# EAGLE design NervousSys_V5 (EAGLE 9.2.2)
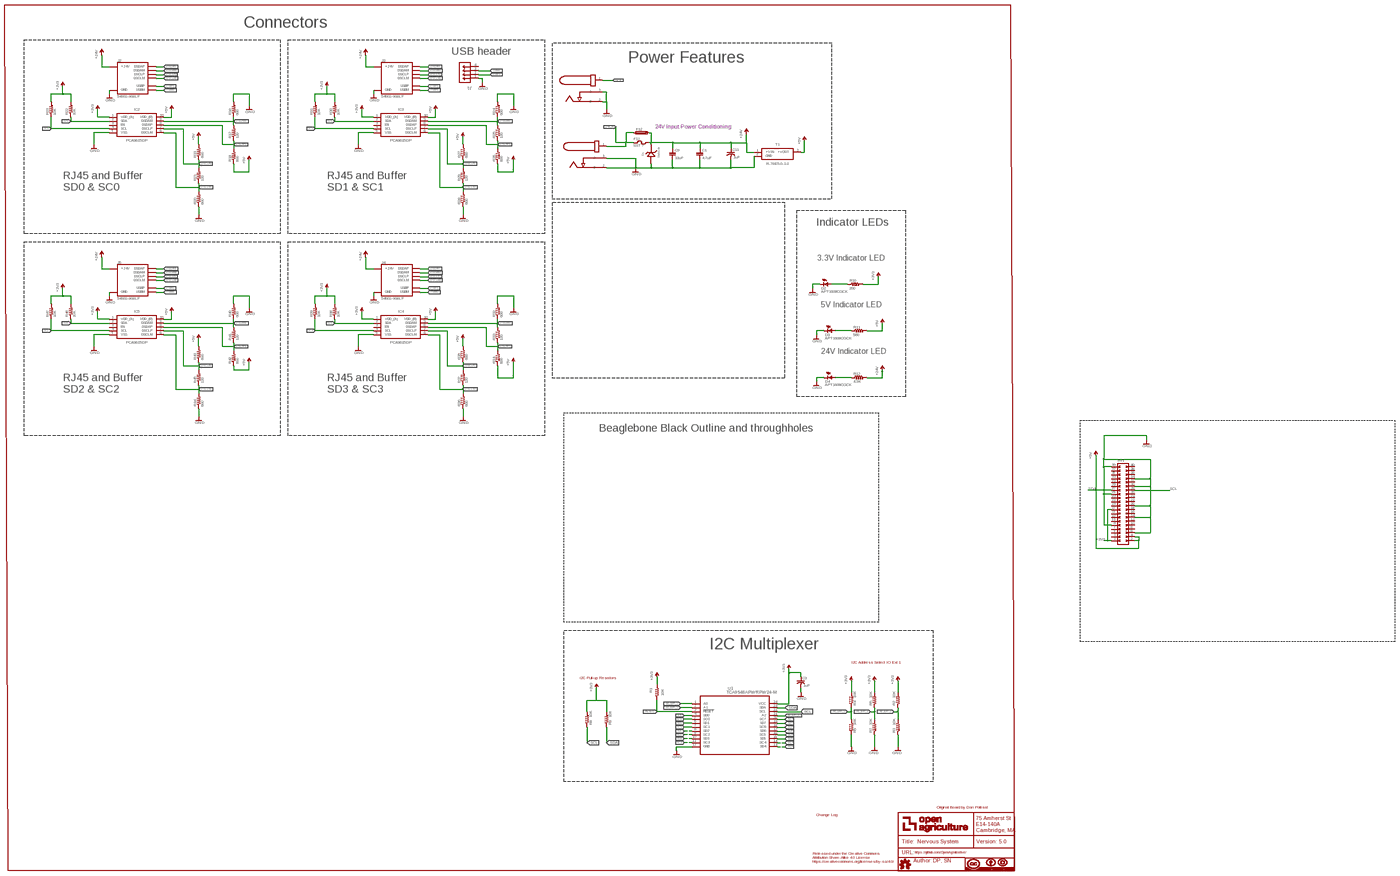
[diagram p0: schematic, sheet 1, overview]
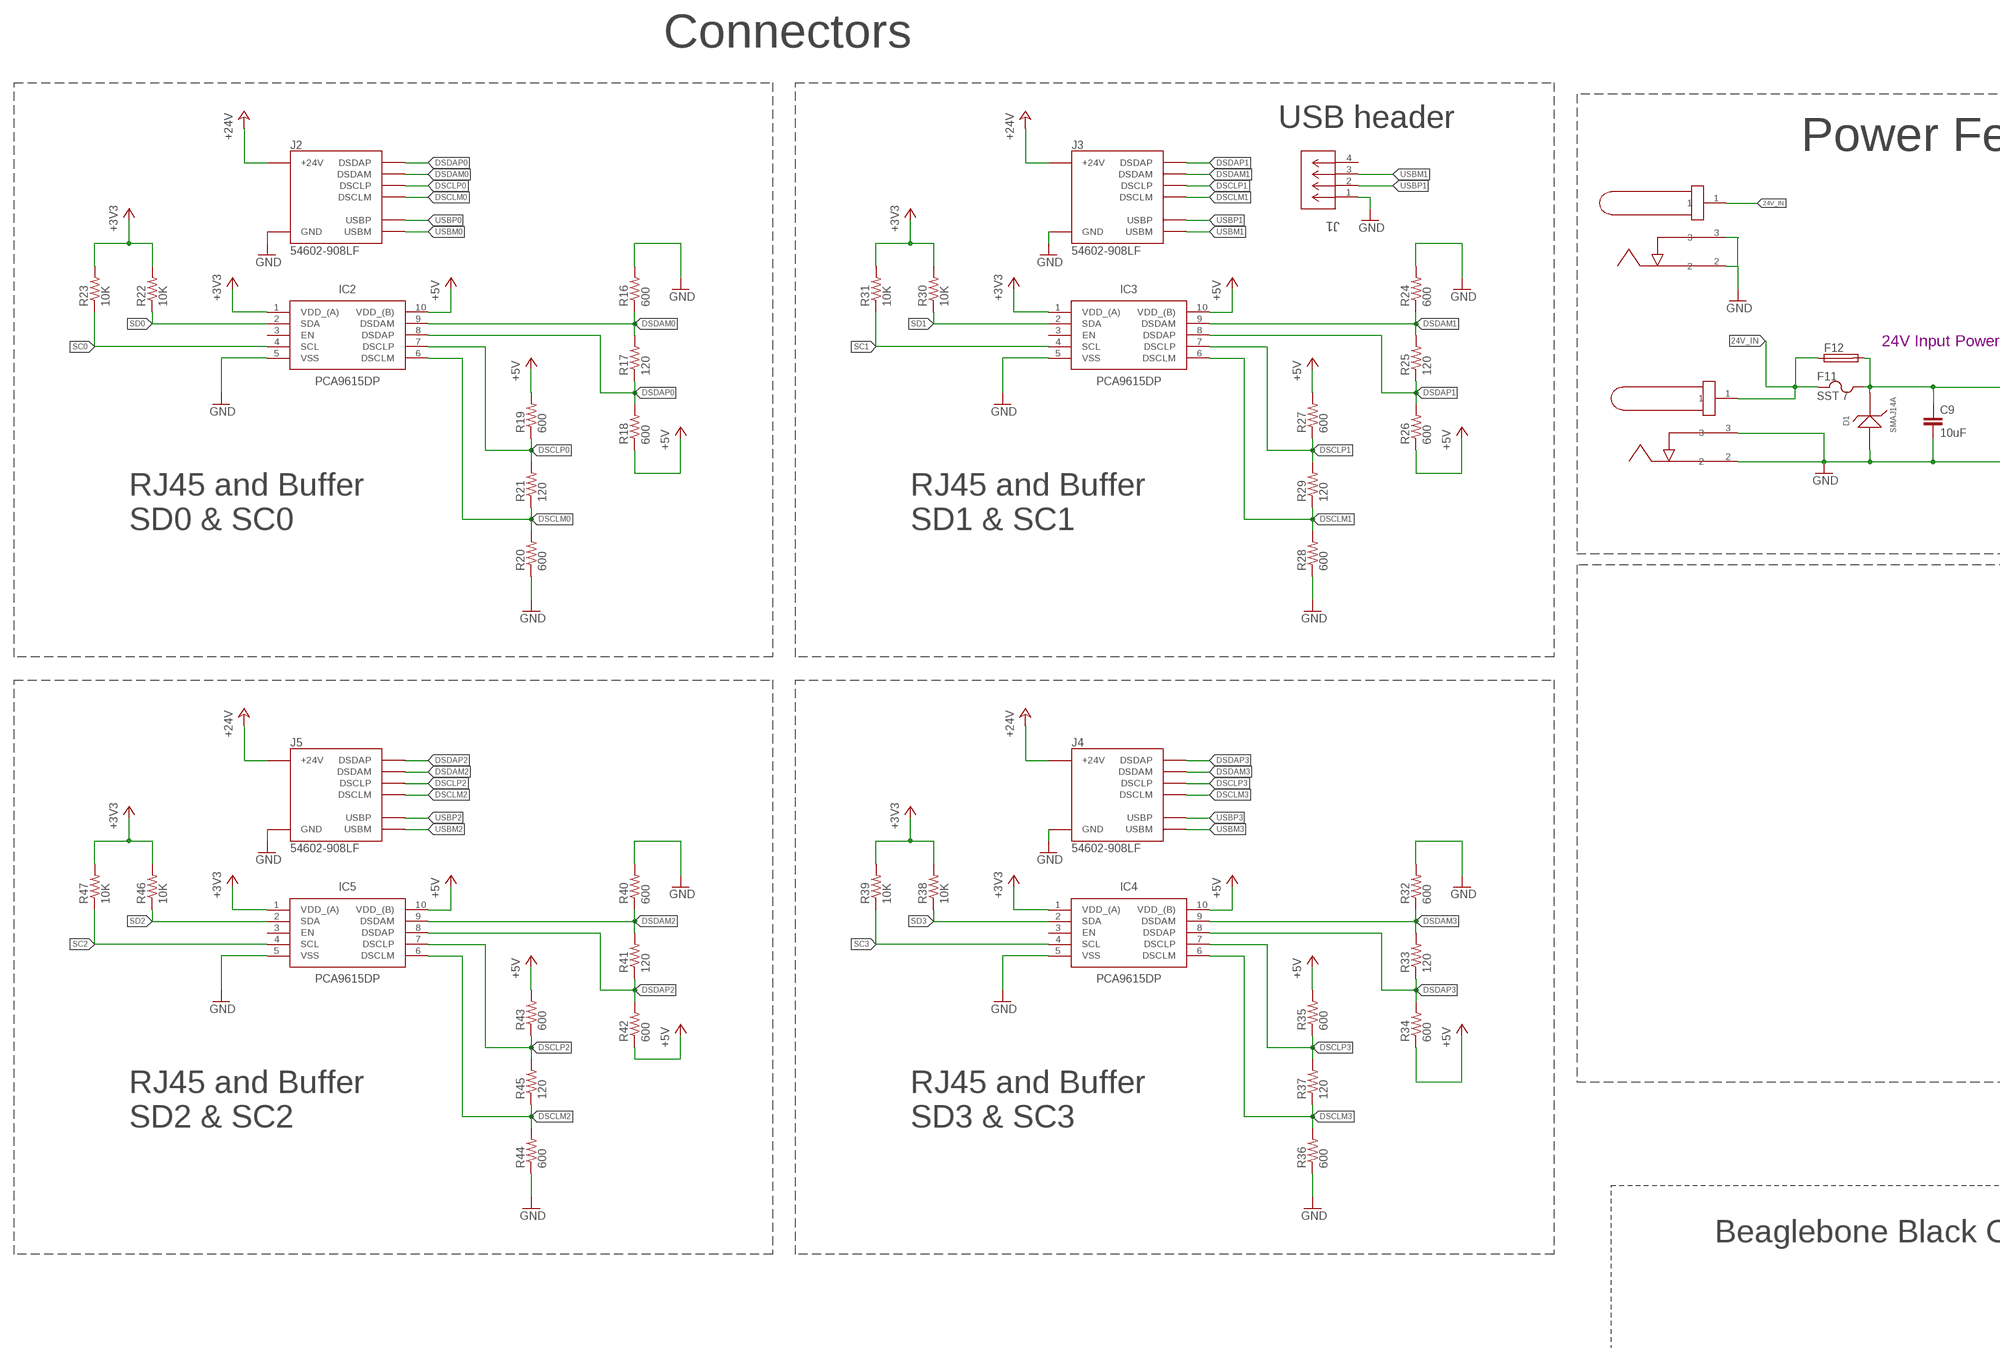
[diagram p1: schematic, sheet 1, part 1 of 4]
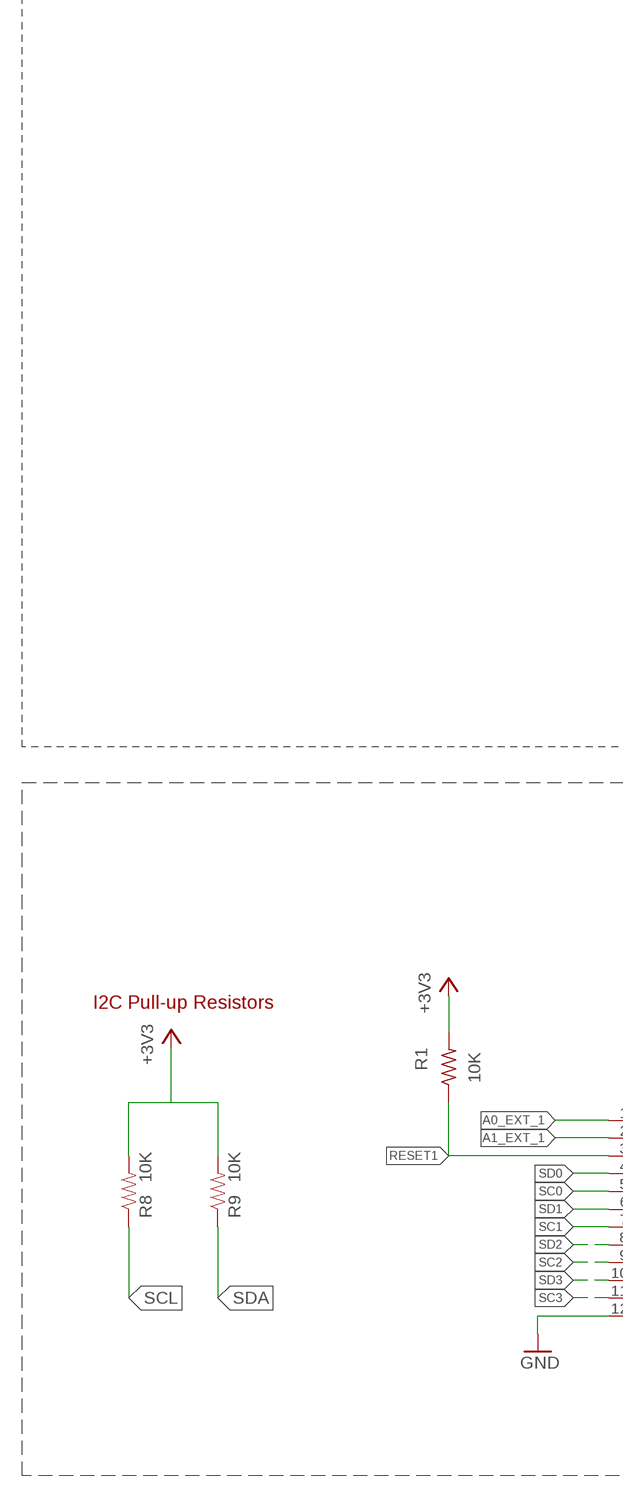
[diagram p2: schematic, sheet 1, part 2 of 4]
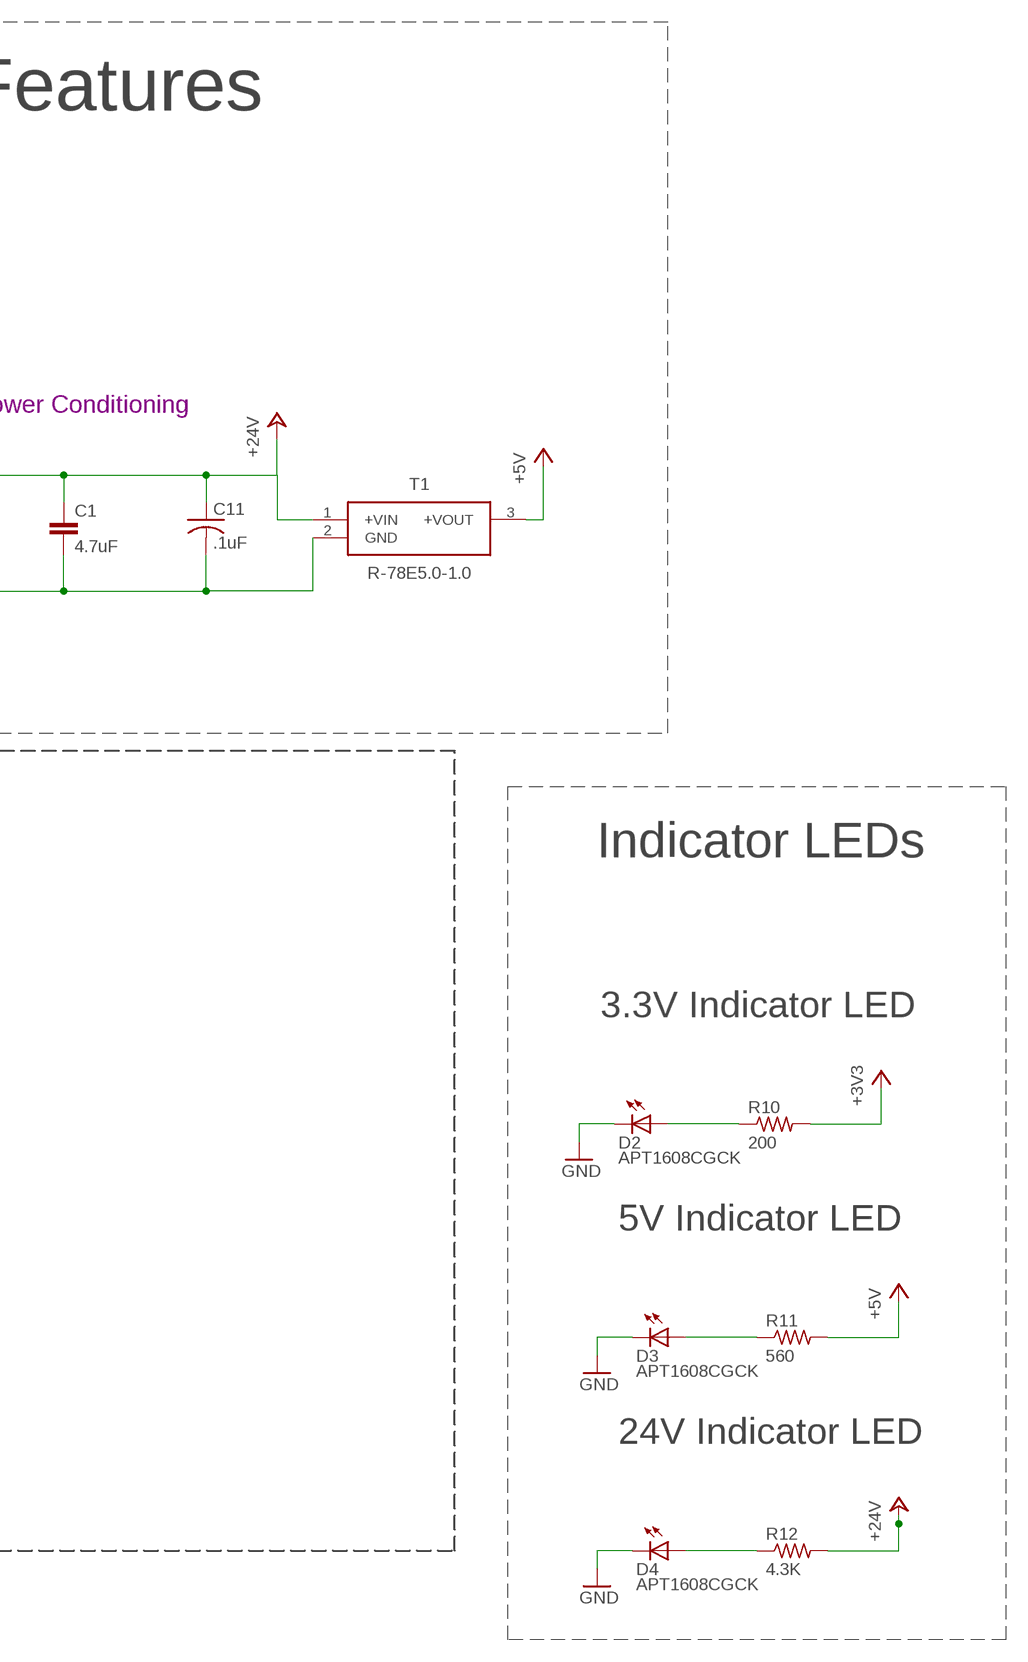
[diagram p3: schematic, sheet 1, part 3 of 4]
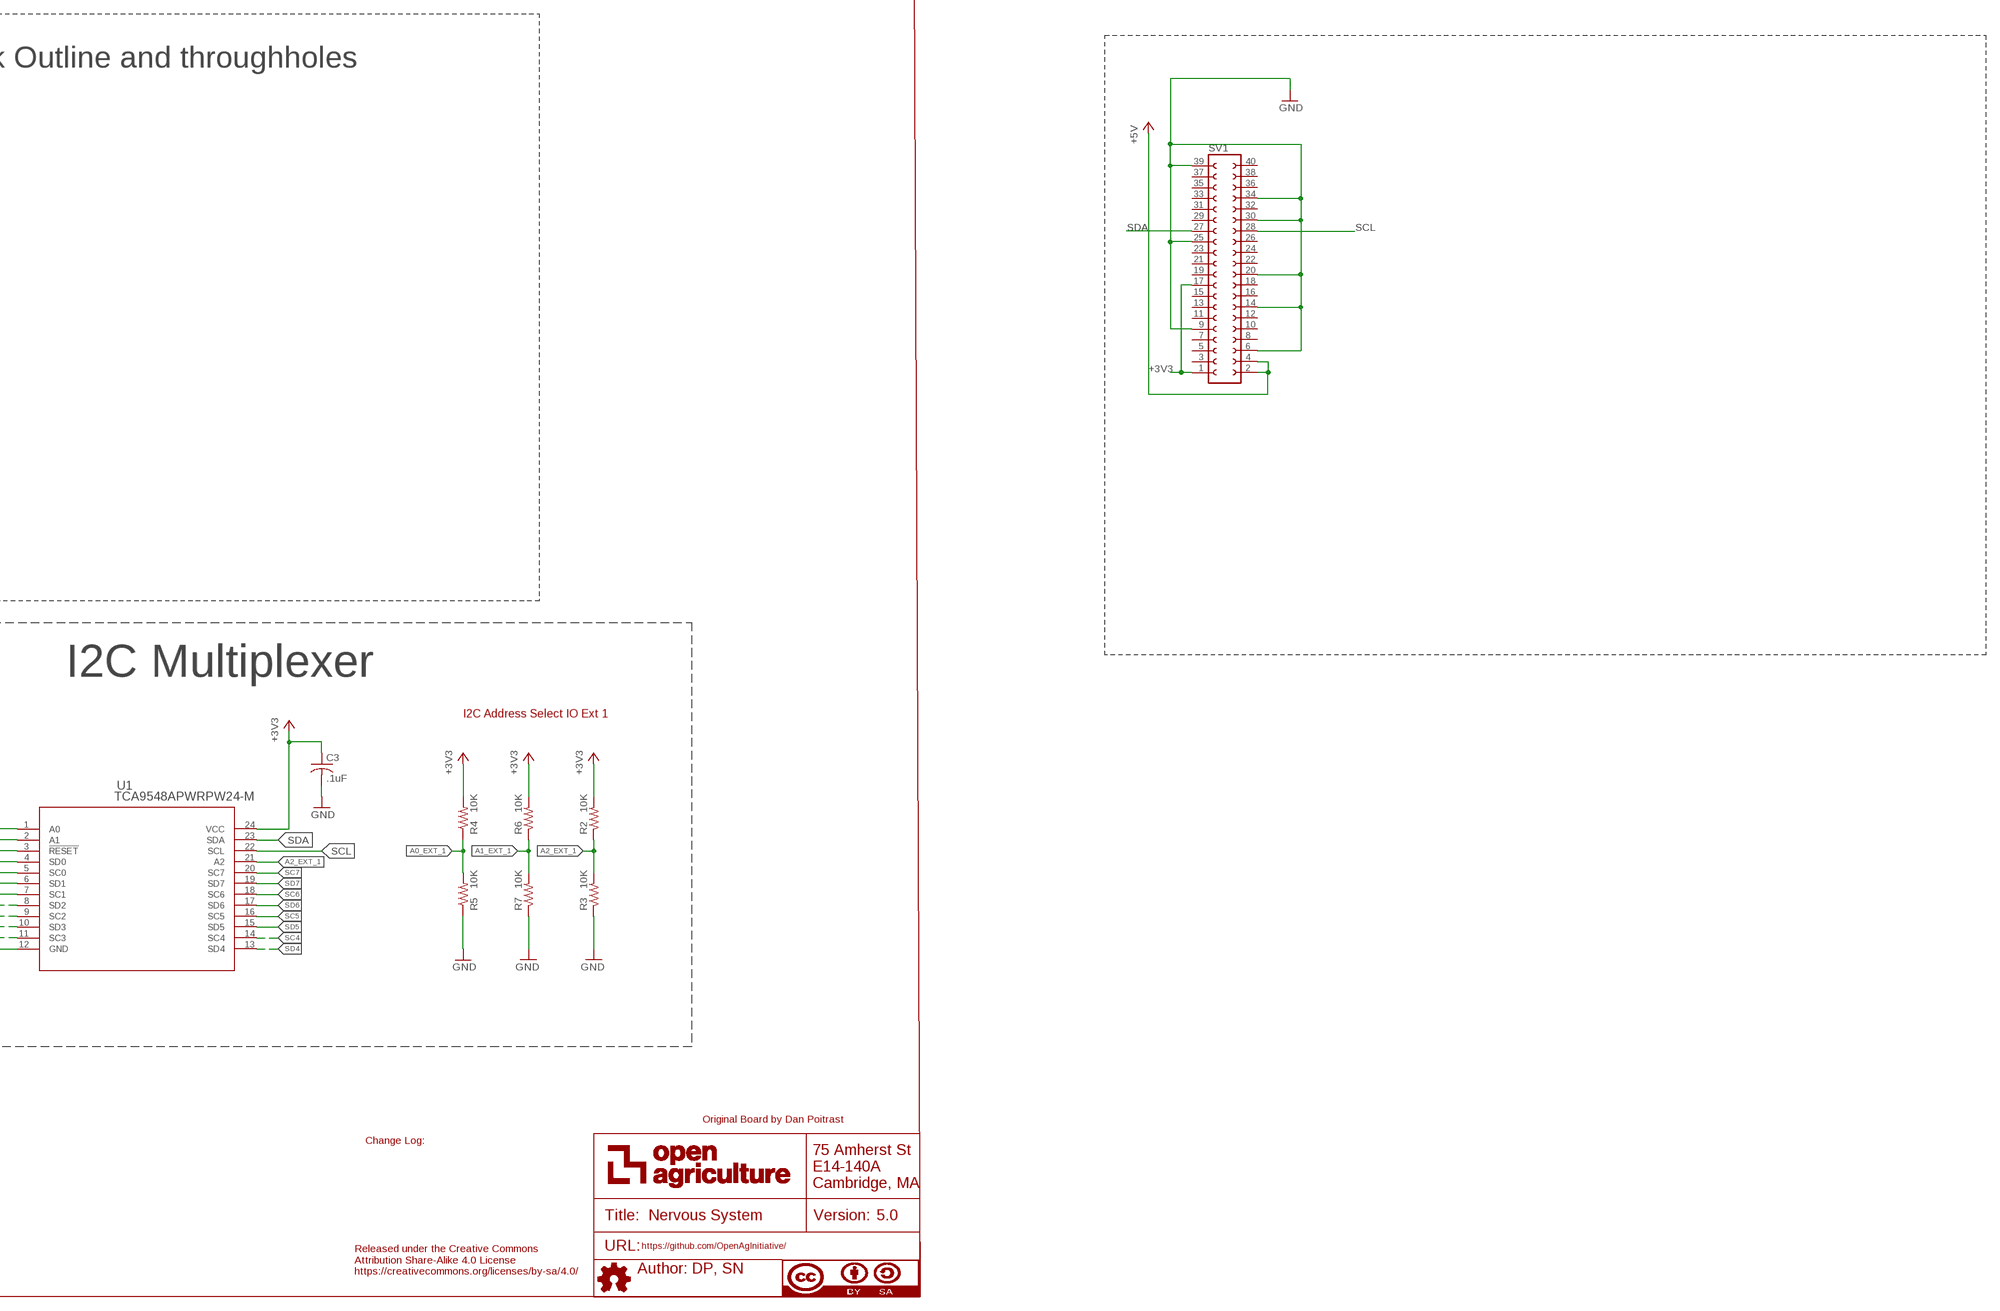
[diagram p4: schematic, sheet 1, part 4 of 4]

## Parts
ATTRIBUTES  DOCFIELD  [DOCFIELD]
C1  4.7uF  4.7UF-C1206C475K5PACTU  [CAP_C1206]
C3  .1uF  C-USC0603  [C0603@1]
C9  10uF  10UF-CL31B106KBHNNNE  [C1206]
C11  .1uF  C-USC0603  [C0603@1]
D1  SMAJ14A  [DO-214AC]
D2  APT1608CGCK  [CHIPLED_0603]
D3  APT1608CGCK  [CHIPLED_0603]
D4  APT1608CGCK  [CHIPLED_0603]
F11  SST 7  SST_7  [SS]
F12  GSH15  [GSH15]
IC2  PCA9615DP  [SOP50P490X110-10N]
IC3  PCA9615DP  [SOP50P490X110-10N]
IC4  PCA9615DP  [SOP50P490X110-10N]
IC5  PCA9615DP  [SOP50P490X110-10N]
J1  87583-2010BLF  [CONN_USB-87583]
J2  54602-908LF  OPENAG-V1-RJ45PTH  [OPENAG-V1-RJ45]
J3  54602-908LF  OPENAG-V1-RJ45PTH  [OPENAG-V1-RJ45]
J4  54602-908LF  OPENAG-V1-RJ45PTH  [OPENAG-V1-RJ45]
J5  54602-908LF  OPENAG-V1-RJ45PTH  [OPENAG-V1-RJ45]
R1  10K  R-US_R0603  [R0603]
R2  10K  10KOHM-1/10W-1%(0603)0603  [0603-RES]
R3  10K  10KOHM-1/10W-1%(0603)0603  [0603-RES]
R4  10K  10KOHM-1/10W-1%(0603)0603  [0603-RES]
R5  10K  10KOHM-1/10W-1%(0603)0603  [0603-RES]
R6  10K  10KOHM-1/10W-1%(0603)0603  [0603-RES]
R7  10K  10KOHM-1/10W-1%(0603)0603  [0603-RES]
R8  10K  10KOHM-1/10W-1%(0603)0603  [0603-RES]
R9  10K  10KOHM-1/10W-1%(0603)0603  [0603-RES]
R10  200  100OHM-RC0603JR-07100RL  [RC0603N]
R11  560  100OHM-RC0603JR-07100RL  [RC0603N]
R12  4.3K  100OHM-RC0603JR-07100RL  [RC0603N]
R16  600  R-US_R0603  [R0603]
R17  120  R-US_R0603  [R0603]
R18  600  R-US_R0603  [R0603]
R19  600  R-US_R0603  [R0603]
R20  600  R-US_R0603  [R0603]
R21  120  R-US_R0603  [R0603]
R22  10K  R-US_R0603  [R0603]
R23  10K  R-US_R0603  [R0603]
R24  600  R-US_R0603  [R0603]
R25  120  R-US_R0603  [R0603]
R26  600  R-US_R0603  [R0603]
R27  600  R-US_R0603  [R0603]
R28  600  R-US_R0603  [R0603]
R29  120  R-US_R0603  [R0603]
R30  10K  R-US_R0603  [R0603]
R31  10K  R-US_R0603  [R0603]
R32  600  R-US_R0603  [R0603]
R33  120  R-US_R0603  [R0603]
R34  600  R-US_R0603  [R0603]
R35  600  R-US_R0603  [R0603]
R36  600  R-US_R0603  [R0603]
R37  120  R-US_R0603  [R0603]
R38  10K  R-US_R0603  [R0603]
R39  10K  R-US_R0603  [R0603]
R40  600  R-US_R0603  [R0603]
R41  120  R-US_R0603  [R0603]
R42  600  R-US_R0603  [R0603]
R43  600  R-US_R0603  [R0603]
R44  600  R-US_R0603  [R0603]
R45  120  R-US_R0603  [R0603]
R46  10K  R-US_R0603  [R0603]
R47  10K  R-US_R0603  [R0603]
SV1  FE20-2  [FE20-2]
T1  R-78E5.0-1.0  [R-78E5.0-1.0]
U1  TCA9548APWRPW24-M  [PW24-M]
U$1  PJ-036AH  [PJ-036AH]
U$3  PJ-036AH  [PJ-036AH]

## Nets
24V_IN: F11.1 F12.1 U$1.1 U$3.1
+3V3: C3.1 IC2.1(VDD_(A)) IC3.1(VDD_(A)) IC4.1(VDD_(A)) IC5.1(VDD_(A)) R1.2 R2.2 R4.2 R6.2 R8.2 R9.2 R10.2 R22.2 R23.2 R30.2 R31.2 R38.2 R39.2 R46.2 R47.2 SV1.1 SV1.17 U1.24(VCC)
+5V: IC2.10(VDD_(B)) IC3.10(VDD_(B)) IC4.10(VDD_(B)) IC5.10(VDD_(B)) R11.2 R18.1 R19.2 R26.1 R27.2 R34.1 R35.2 R42.1 R43.2 SV1.2 SV1.4 T1.3(+VOUT)
+24V: C1.1 C9.1 C11.1 D1.C F11.2 F12.2 J2.24V(6)(+24V) J3.24V(6)(+24V) J4.24V(6)(+24V) J5.24V(6)(+24V) R12.2 T1.1(+VIN)
A0_EXT_1: R4.1 R5.2 U1.1(A0)
A1_EXT_1: R6.1 R7.2 U1.2(A1)
A2_EXT_1: R2.1 R3.2 U1.21(A2)
DSCLM0: IC2.6(DSCLM) J2.DSCLM(5)(DSCLM) R20.2 R21.1
DSCLM1: IC3.6(DSCLM) J3.DSCLM(5)(DSCLM) R28.2 R29.1
DSCLM2: IC5.6(DSCLM) J5.DSCLM(5)(DSCLM) R44.2 R45.1
DSCLM3: IC4.6(DSCLM) J4.DSCLM(5)(DSCLM) R36.2 R37.1
DSCLP0: IC2.7(DSCLP) J2.DSCLP(4)(DSCLP) R19.1 R21.2
DSCLP1: IC3.7(DSCLP) J3.DSCLP(4)(DSCLP) R27.1 R29.2
DSCLP2: IC5.7(DSCLP) J5.DSCLP(4)(DSCLP) R43.1 R45.2
DSCLP3: IC4.7(DSCLP) J4.DSCLP(4)(DSCLP) R35.1 R37.2
DSDAM0: IC2.9(DSDAM) J2.DSDAM(2)(DSDAM) R16.1 R17.2
DSDAM1: IC3.9(DSDAM) J3.DSDAM(2)(DSDAM) R24.1 R25.2
DSDAM2: IC5.9(DSDAM) J5.DSDAM(2)(DSDAM) R40.1 R41.2
DSDAM3: IC4.9(DSDAM) J4.DSDAM(2)(DSDAM) R32.1 R33.2
DSDAP0: IC2.8(DSDAP) J2.DSDAP(1)(DSDAP) R17.1 R18.2
DSDAP1: IC3.8(DSDAP) J3.DSDAP(1)(DSDAP) R25.1 R26.2
DSDAP2: IC5.8(DSDAP) J5.DSDAP(1)(DSDAP) R41.1 R42.2
DSDAP3: IC4.8(DSDAP) J4.DSDAP(1)(DSDAP) R33.1 R34.2
GND: C1.2 C3.2 C9.2 C11.2 D1.A D2.C D3.C D4.C IC2.5(VSS) IC3.5(VSS) IC4.5(VSS) IC5.5(VSS) J1.1 J2.GND(3)(GND) J3.GND(3)(GND) J4.GND(3)(GND) J5.GND(3)(GND) R3.1 R5.1 R7.1 R16.2 R20.1 R24.2 R28.1 R32.2 R36.1 R40.2 R44.1 SV1.6 SV1.9 SV1.14 SV1.20 SV1.25 SV1.30 SV1.34 SV1.39 T1.2(GND) U1.12(GND) U$1.2 U$1.3 U$3.2 U$3.3
N$2: D3.A R11.1
N$4: D4.A R12.1
N$12: D2.A R10.1
RESET1: R1.1 U1.3(!RESET)
SC0: IC2.4(SCL) R23.1 U1.5(SC0)
SC1: IC3.4(SCL) R31.1 U1.7(SC1)
SC2: IC5.4(SCL) R47.1 U1.9(SC2)
SC3: IC4.4(SCL) R39.1 U1.11(SC3)
SC4: U1.14(SC4)
SC5: U1.16(SC5)
SC6: U1.18(SC6)
SC7: U1.20(SC7)
SCL: R8.1 SV1.28 U1.22(SCL)
SD0: IC2.2(SDA) R22.1 U1.4(SD0)
SD1: IC3.2(SDA) R30.1 U1.6(SD1)
SD2: IC5.2(SDA) R46.1 U1.8(SD2)
SD3: IC4.2(SDA) R38.1 U1.10(SD3)
SD4: U1.13(SD4)
SD5: U1.15(SD5)
SD6: U1.17(SD6)
SD7: U1.19(SD7)
SDA: R9.1 SV1.27 U1.23(SDA)
USBM0: J2.USBM(8)(USBM)
USBM1: J1.3 J3.USBM(8)(USBM)
USBM2: J5.USBM(8)(USBM)
USBM3: J4.USBM(8)(USBM)
USBP0: J2.USBP(7)(USBP)
USBP1: J1.2 J3.USBP(7)(USBP)
USBP2: J5.USBP(7)(USBP)
USBP3: J4.USBP(7)(USBP)
Unconnected: IC2.3(EN) IC3.3(EN) IC4.3(EN) IC5.3(EN) J1.4 SV1.3 SV1.5 SV1.7 SV1.8 SV1.10 SV1.11 SV1.12 SV1.13 SV1.15 SV1.16 SV1.18 SV1.19 SV1.21 SV1.22 SV1.23 SV1.24 SV1.26 SV1.29 SV1.31 SV1.32 SV1.33 SV1.35 SV1.36 SV1.37 SV1.38 SV1.40

## Notes on the sheet
- Connectors
- USB header
- Power Features
- 24V Input Power Conditioning
- RJ45 and Buffer
  SD0 & SC0
- RJ45 and Buffer
  SD1 & SC1
- Indicator LEDs
- 3.3V Indicator LED
- 5V Indicator LED
- 24V Indicator LED
- RJ45 and Buffer
  SD2 & SC2
- RJ45 and Buffer
  SD3 & SC3
- Beaglebone Black Outline and throughholes
- I2C Multiplexer
- I2C Address Select IO Ext 1
- I2C Pull-up Resistors
- Original Board by Dan Poitrast
- Change Log:
- Released under the Creative Commons
  Attribution Share-Alike 4.0 License
  https://creativecommons.org/licenses/by-sa/4.0/

## Library data of the parts
ATTRIBUTES = openag-frames:DOCFIELD: DOCUMENT FIELD; AUTHOR: DP, SN; DESCRIPTION: Nervous System; TITLE: Nervous System; URL: https://github.com/OpenAgInitiative/; VER: 5.0
C1 = openag-capacitors:4.7UF-C1206C475K5PACTU: Kemet - C1206C475K5PACTU - CAP CER 4.7UF 50V X5R 1206 Description: 4.7�F �10% 50V Ceramic Capacitor X5R 1206 (3216 Metric) Technical Specifications: Capacitance: 4.7uF Tolerance: ±10% Rated Voltage: 50V Temperature Coefficient: X5R Operating Temperature: -55°C ~ 85°C Package/Case: 1206 (3216 Metric) Datasheet(s): https://media.digikey.com/pdf/Data%20Sheets/Kemet%20PDFs/C1206C475K5PAC.pdf Vendor(s): Digikey: 399-5507-1-ND <https://www.digikey.com/product-detail/en/kemet/C1206C475K5PACTU/399-5507-1-ND/1950685>; POPULATE: YES; VERIFIED: NO
C3 C11 = rcl:C-US: CAPACITOR, American symbol
C9 = openag-capacitors:10UF-CL31B106KBHNNNE: Samsung - CL31B106KBHNNNE - CAP CER 10UF 50V X7R 1206 Description: 10�F �10% 50V Ceramic Capacitor X7R 1206 (3216 Metric) Technical Specifications: Capacitance: 10uF Tolerance: ±10% Rated Voltage: 50V Temperature Coefficient: X7R Operating Temperature: -55°C ~ -125°C Package/Case: 1206 (3216 Metric) Datasheet(s): CL Series, MLCC Datasheet <https://media.digikey.com/pdf/Data%20Sheets/Samsung%20PDFs/CL_Series_MLCC_ds.pdf> Vendor(s): Digikey: 1276-6767-1-ND <https://www.digikey.com/product-detail/en/samsung-electro-mechanics-america-inc/CL31B106KBHNNNE/1276-6767-1-ND/5961626>; POPULATE: YES; VERIFIED: NO
D1 = openag-diodes:SMAJ14A: TVS DIODE 14VWM 23.2VC SMA - Littlefuse - SMAJ14A - SMAJ14ALFCT-ND Description: The SMAJ series is designed specifically to protect sensitive electronic equipment from voltage transients induced by lightning and other transient voltage events Technical Specifications: Type: Zener Voltage - Reverse Standoff (Typ): 14V Voltage - Breakdown (Min): 15.6V Voltage - Clamping (Max) @ Ipp: 23.2V Current - Peak Pulse (10/1000�s): 17.2A Operating Temperature: -55�C ~ 150�C (TJ) Mounting Type: Surface Mount Package / Case: DO-214AC, SMA Datasheet(s): SMAJ Series <http://www.littelfuse.com/~/media/electronics/datasheets/tvs_diodes/littelfuse_tvs_diode_smaj_datasheet.pdf.pdf> Vendor(s): Digikey: SMAJ14ALFCT-ND <https://www.digikey.com/product-detail/en/littelfuse-inc/SMAJ14A/SMAJ14ALFCT-ND/762486>; POPULATE: YES; VERIFIED: NO
D2-D4 = openag-diodes:APT1608CGCK: Kingbright - APT1608CGCK - LED GREEN CLEAR 0603 SMD Description: Green 570nm LED Indication - Discrete 2.1V 0603 (1608 Metric) Technical Specifications: Color: Green Lens Color: Colorless Lens Transparency: Clear Millicandela Rating: 50mcd Lens Style/Size: Rectangle with Flat Top, 1.20mm x 0.80mm Voltage - Forward (Vf) (Typ): 2.1V Current - Test: 20mA Viewing Angle: 120° Mounting Type: Surface Mount Wavelength - Dominant: 570nm Wavelength - Peak: 574nm Package / Case: 0603 (1608 Metric) Supplier Device Package: Chip LED Size / Dimension: 1.60mm L x 0.80mm W Height (Max): 0.75mm Datasheet(s): APT1608CGCK <http://www.kingbrightusa.com/images/catalog/SPEC/APT1608CGCK.pdf> Vendor(s): Digikey: 754-1116-1-ND <https://www.digikey.com/product-detail/en/kingbright/APT1608CGCK/754-1116-1-ND/1747833#>; POPULATE: YES; VERIFIED: NO
F11 = openag-fuses:SST_7: Bel Fuse - SST7 - FUSE BRD MNT 7A 125VAC/VDC 2SMD Description: FUSE BRD MNT 7A 125VAC/VDC 2SMD Technical Specifications: Current Rating: 7A Voltage Rating: 125V Fuse Type: Board Mount (Cartridge Style Excluded) Mounting Type: Surface Mount Operating Temperature: -55�C ~ 125�C Datasheet(s): SST Type <https://belfuse.com/resources/StewartConnector/SST.pdf> Vendor(s): Digikey: 507-1072-1-ND <https://www.digikey.com/product-detail/en/bel-fuse-inc/SST-7/507-1072-1-ND/615026>; POPULATE: YES; VERIFIED: NO
F12 = fuse:GSH15: FUSE HOLDER grid 15mm, 19649 Wickmann; MPN: 64900001039; OC_FARNELL: 1271673; OC_NEWARK: 02P0318
IC2-IC5 = PCA9615DP:PCA9615DP: Buffer, ReDriver 2 Channel 400kHz 10-TSSOP Source: Datasheet <http://www.nxp.com/docs/en/data-sheet/PCA9615.pdf>; DESCRIPTION: Buffer, ReDriver 2 Channel 400kHz 10-TSSOP; HEIGHT: 1.1mm; MANUFACTURER_NAME: Nexperia; MANUFACTURER_PART_NUMBER: PCA9615DP; SUPPLIER_NAME: RS
J1 = openag-connectors:87583-2010BLF; MANUFACTURER_PART_NUMBER: 875832010BLF; VENDOR: Amphenol FCI
J2-J5 = openag_connector:OPENAG-V1-RJ45: Amphenol FCI - 54602-908LF - CONN MOD JACK 8P8C R/A UNSHLD Description: Jack Modular Connector 8p8c (RJ45, Ethernet) 90� Angle (Right) Unshielded Cat3 Technical Specifications: Connector Type: Jack Number of Positions/Contacts: 8p8c (RJ45, Ethernet) Number of Ports: 1 Number of Rows: 1 Mounting Type: Through Hole Orientation: 90� Angle (Right) Termination: Solder Shielding: Unshielded Ratings: Cat3 Features: Board Lock LED Color: Does Not Contain LED Tab Direction: Down Contact Material: Copper Alloy Contact Finish: Gold Contact Finish Thickness: 15�in (0.38�m) Housing Material: Polyester, Glass Filled Operating Temperature: -40�C ~ 70�C Datasheet(s): 54601-x04(zzz)WPLF Drawing <http://cdn.amphenol-icc.com/media/wysiwyg/files/drawing/c-bmj-0102.pdf> Vendor(s): Digikey: 609-1046-ND <https://www.digikey.com/product-detail/en/amphenol-fci/54602-908LF/609-1046-ND/1001360>; POPULATE: YES; VERIFIED: NO
R1 R16-R47 = rcl:R-US_: RESISTOR, American symbol; SPICEPREFIX: R
R2-R9 = SparkFun-Resistors:10KOHM-1/10W-1%(0603): RES-00824; PROD_ID: RES-00824
R10-R12 = openag-resistors:100OHM-RC0603JR-07100RL: Yageo - RC0603JR-07100RL - RES SMD 100 OHM 5% 1/10W 0603 Description: 100 Ohms ±5% 0.1W, 1/10W Chip Resistor 0603 (1608 Metric) Moisture Resistant Thick Film Technical Specifications: Resistance: 100 Ohms Tolerance: ±5% Power (Watts): 0.1W, 1/10W Composition: Thick Film Features: Moisture Resistant Temperature Coefficient: ±100ppm/°C Operating Temperature: -55°C ~ 155°C Package / Case: 0603 (1608 Metric) Supplier Device Package: 0603 Size / Dimension: 0.063" L x 0.032" W (1.60mm x 0.80mm) Height - Seated (Max): 0.022" (0.55mm) Number of Terminations: 2 Datasheet(s): Thick Film Chip Resistor Intro <http://www.yageo.com.tw/exep/pages/download/literatures/PYu-R_INT-thick_7.pdf> Chip Resistor Marking <http://www.yageo.com/exep/pages/download/literatures/PYu-R_Marking_2.pdf> RC Series, L Datasheet <http://www.yageo.com/documents/recent/PYu-RC_Group_51_RoHS_L_8.pdf> Vendor(s): Digikey: 311-100GRCT-ND <https://www.digikey.com/product-detail/en/yageo/RC0603JR-07100RL/311-100GRCT-ND/729644>; POPULATE: YES; VALUE: 100 OHM; VERIFIED: NO
SV1 = con-lsta:FE20-2: FEMALE HEADER; OC_FARNELL: unknown; OC_NEWARK: unknown
T1 = R-78E5.0-1.0:R-78E5.0-1.0: Non-Isolated DC/DC Converters 8-28Vin 5V 1.0A THRU <https://componentsearchengine.com/Images/1/R-78E5.0-1.0.jpg> Source: Datasheet <http://www.recom-power.com/pdf/Innoline/R-78Exx-1.0.pdf>; DESCRIPTION: Non-Isolated DC/DC Converters 8-28Vin 5V 1.0A THRU; HEIGHT: mm; MANUFACTURER_NAME: RECOM Power; MANUFACTURER_PART_NUMBER: R-78E5.0-1.0; RS_PART_NUMBER: 1446290; SUPPLIER_NAME: RS
U1 = OpenAG_I2C:TCA9548APWR; MANUFACTURER_PART_NUMBER: TCA9548APWR; VENDOR: TEXAS INSTRUMENTS
U$1 U$3 = PJ-036ah:PJ-036AH

## Board
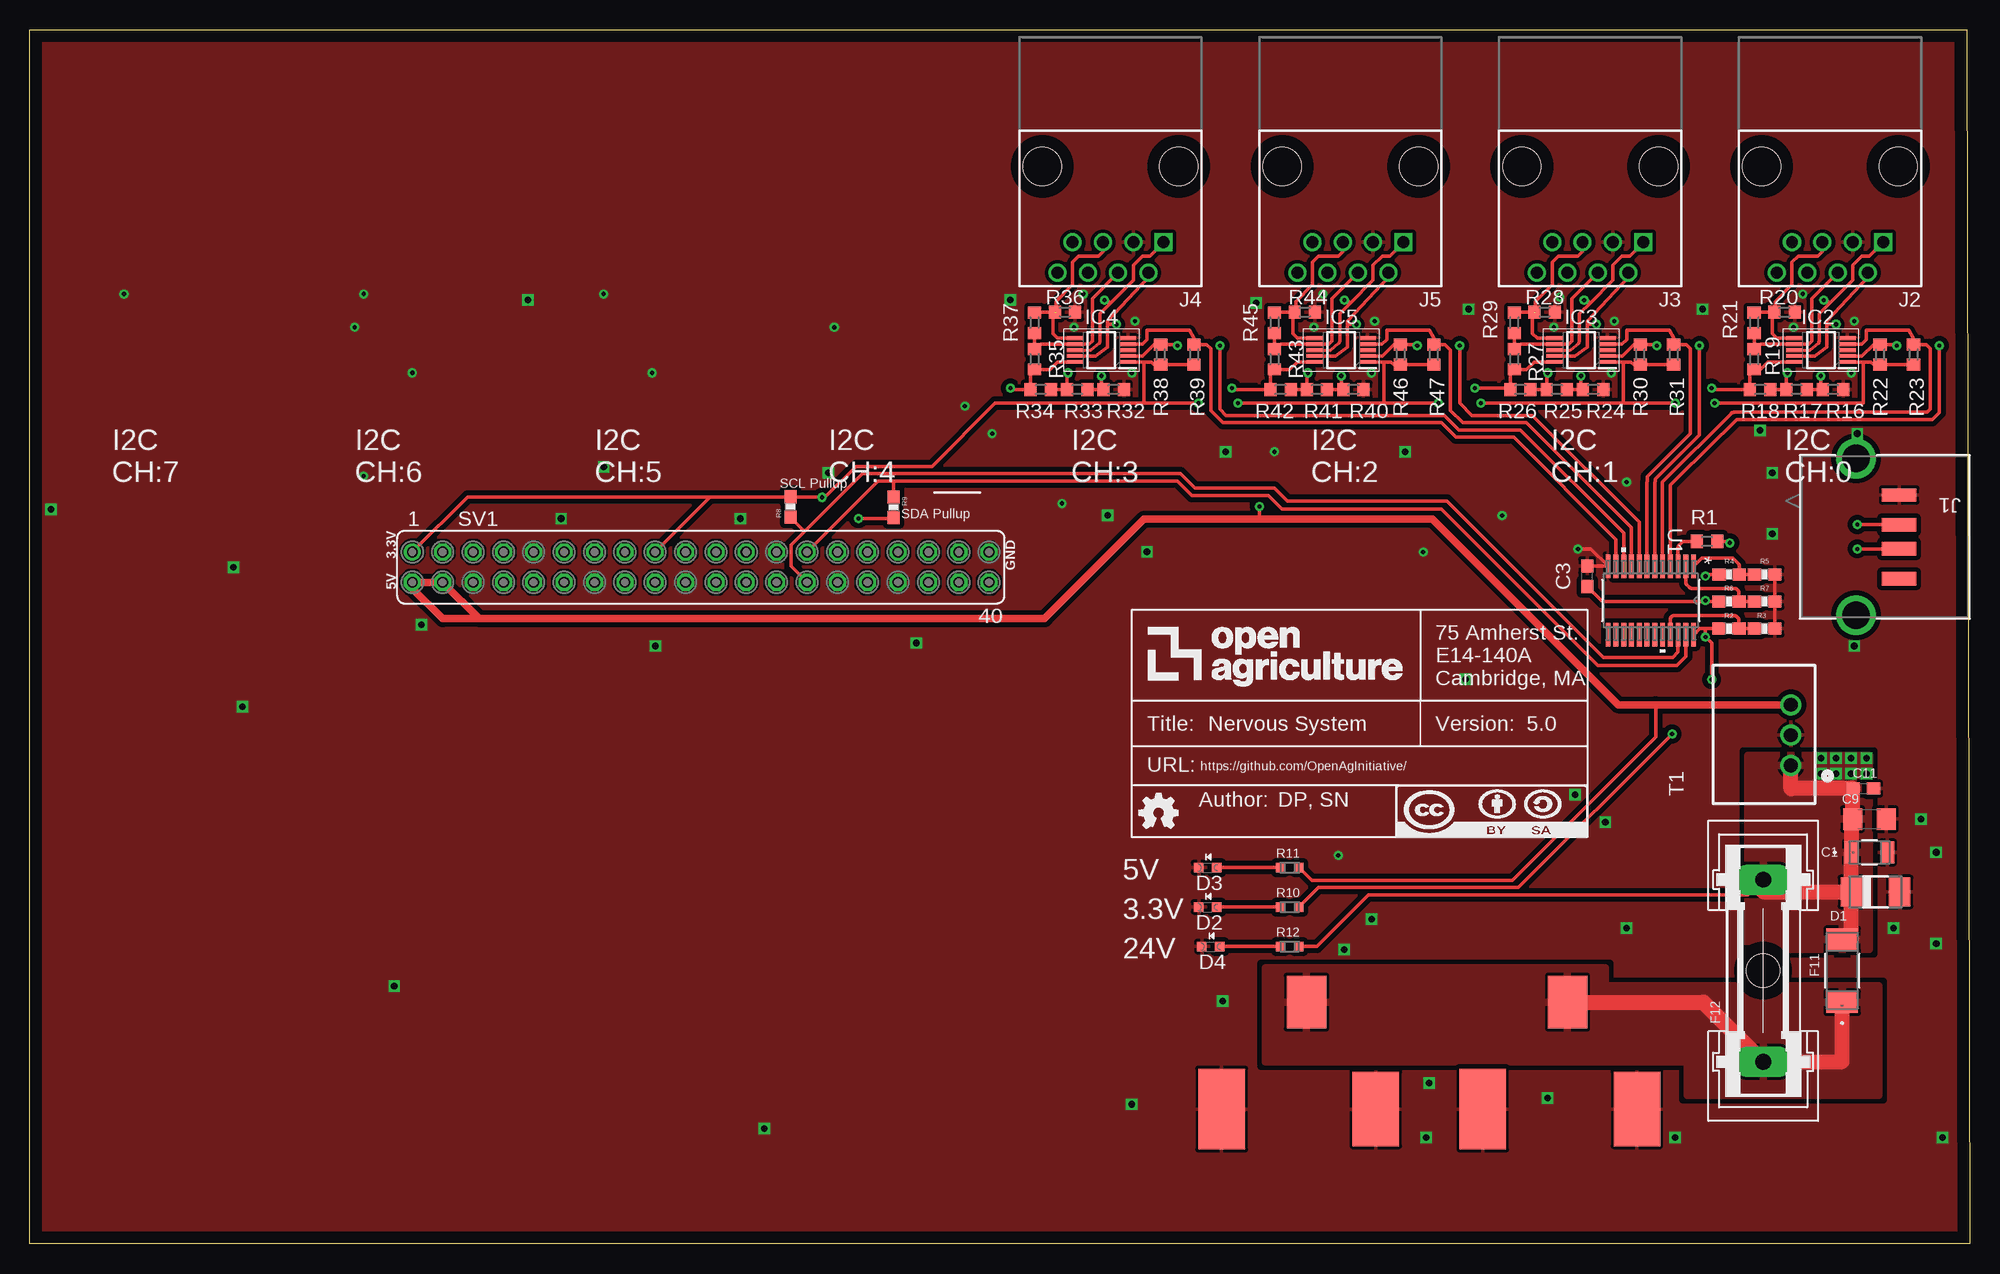
[diagram p5: board, top side]
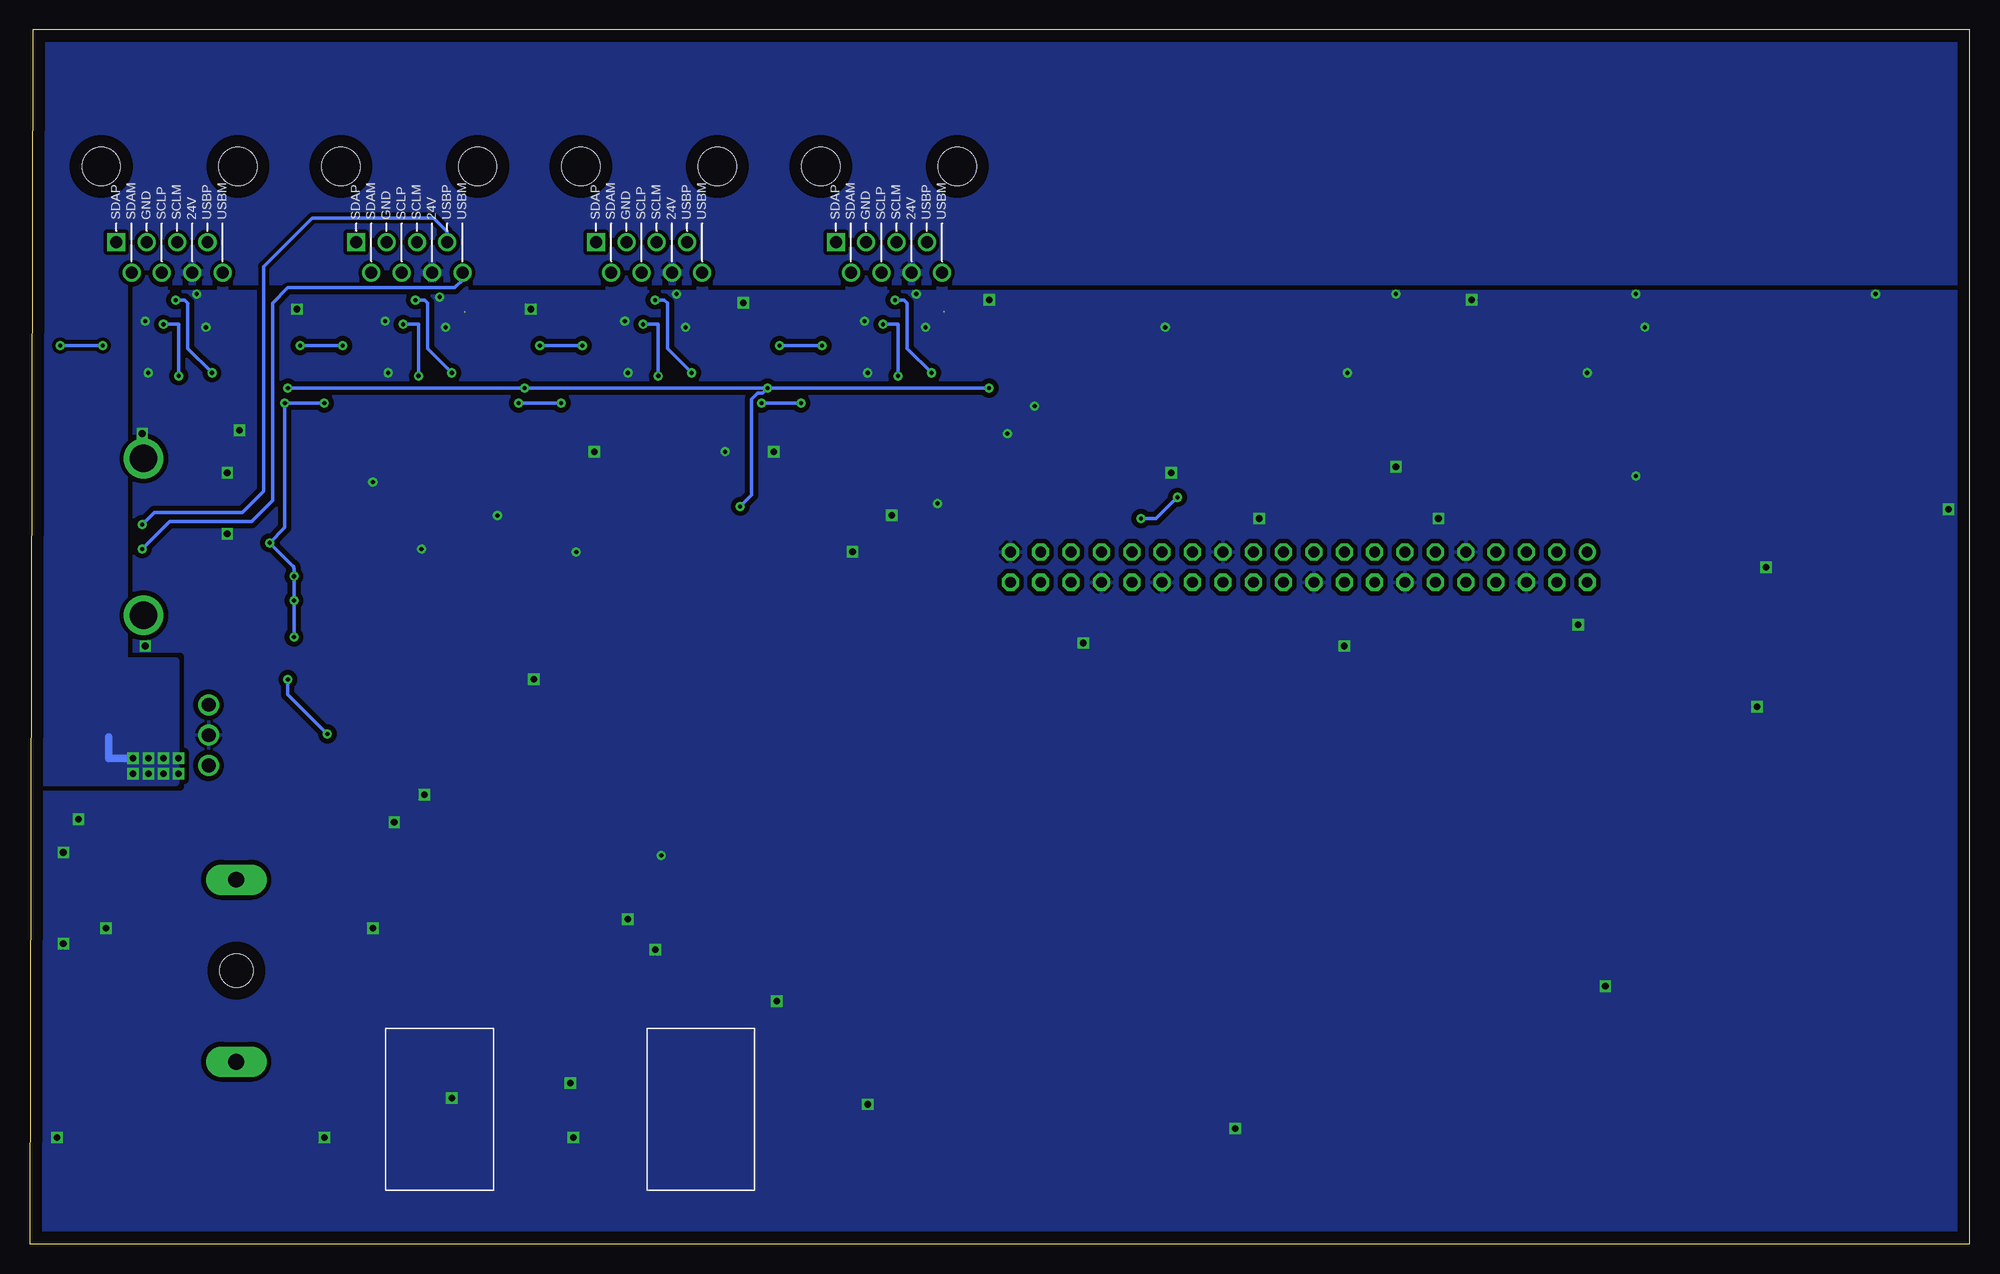
[diagram p6: board, bottom side, seen from below]

Size 162.31 x 101.6 mm. Coordinates in mm from the lower left corner, seen from the top.
Outline: 0,0 0,101.6 162.05,101.6 162.31,0 0,0
Copper layers (1*16): Top 0.035mm / dielectric 1.5mm / Bottom 0.035mm
Design rules "default *": minimum track width 6mil, minimum drill 0.35mm, track to track 12mil, track to pad 12mil, pad to pad 6mil, via to via 6mil, smd to smd 6mil, copper to edge 40mil, drill to drill 6mil, minimum pad ring 10mil, minimum via ring 8mil, stop-mask expansion 4mil, vias tented up to drill 25mil, thermal gap 10mil

### Footprints (pad centres in the part's own frame; a part is rotated, then mirrored left to right if it is on the bottom)
CAP_C1206 = smd 1.118 x 1.803: 1 -1.499,0; 2 1.499,0
C0603@1 = smd 1.1 x 1: 1 -0.85,0; 2 0.85,0
C1206 = smd 1.6 x 1.8: 1 -1.4,0; 2 1.4,0
DO-214AC = smd 1.8 x 2.4: A 2.025,0; C -2.025,0
CHIPLED_0603 = smd 0.8 x 0.8: A 0,-0.75; C 0,0.75
SS = smd 1.803 x 2.642: 1 -2.629,0; 2 2.629,0
GSH15 = drill 1.321 pad 2.54 long: 1 -7.62,0; 2 7.62,0 | hole 2.794: 0,0
SOP50P490X110-10N = smd 1.4 x 0.3: 1 -2.2,1; 2 -2.2,0.5; 3 -2.2,0; 4 -2.2,-0.5; 5 -2.2,-1; 6 2.2,-1; 7 2.2,-0.5; 8 2.2,0; 9 2.2,0.5; 10 2.2,1
CONN_USB-87583 = smd 1.12 x 2.88: 1 -3.492,1.221; 2 -0.992,1.221; 3 1.008,1.221; 4 3.508,1.221 | drill 2.311 pad 2.819: 6 -6.553,-2.388; 7 6.579,-2.388
OPENAG-V1-RJ45 = drill 1: 24V(6) 1.905,8.89; DSCLM(5) 0.635,6.35; DSCLP(4) -0.635,8.89; DSDAM(2) -3.175,8.89; GND(3) -1.905,6.35; USBM(8) 4.445,8.89; USBP(7) 3.175,6.35 | drill 1 square: DSDAP(1) -4.445,6.35 | hole 3.2: -5.715,0; 5.715,0
R0603 = smd 1 x 1.1: 1 -0.85,0; 2 0.85,0
0603-RES = smd 1.1 x 1: 1 -0.85,0; 2 0.85,0
RC0603N = smd 0.756 x 0.8: 1 -0.778,0; 2 0.778,0
FE20-2 = drill 0.914: 1 -24.13,1.27 | drill 0.914 octagon: 2 -24.13,-1.27; 3 -21.59,1.27; 4 -21.59,-1.27; 5 -19.05,1.27; 6 -19.05,-1.27; 7 -16.51,1.27; 8 -16.51,-1.27; 9 -13.97,1.27; 10 -13.97,-1.27; 11 -11.43,1.27; 12 -11.43,-1.27; 13 -8.89,1.27; 14 -8.89,-1.27; 15 -6.35,1.27; 16 -6.35,-1.27; 17 -3.81,1.27; 18 -3.81,-1.27; 19 -1.27,1.27; 20 -1.27,-1.27; 21 1.27,1.27; 22 1.27,-1.27; 23 3.81,1.27; 24 3.81,-1.27; 25 6.35,1.27; 26 6.35,-1.27; 27 8.89,1.27; 28 8.89,-1.27; 29 11.43,1.27; 30 11.43,-1.27; 31 13.97,1.27; 32 13.97,-1.27; 33 16.51,1.27; 34 16.51,-1.27; 35 19.05,1.27; 36 19.05,-1.27; 37 21.59,1.27; 38 21.59,-1.27; 39 24.13,1.27; 40 24.13,-1.27
R-78E5.0-1.0 = drill 1.15 pad 1.75: 1 3.21,2; 2 5.75,2; 3 8.29,2
PW24-M = smd 1.981 x 0.406: 1 -2.87,3.575; 2 -2.87,2.925; 3 -2.87,2.275; 4 -2.87,1.625; 5 -2.87,0.975; 6 -2.87,0.325; 7 -2.87,-0.325; 8 -2.87,-0.975; 9 -2.87,-1.625; 10 -2.87,-2.275; 11 -2.87,-2.925; 12 -2.87,-3.575; 13 2.87,-3.575; 14 2.87,-2.925; 15 2.87,-2.275; 16 2.87,-1.625; 17 2.87,-0.975; 18 2.87,-0.325; 19 2.87,0.325; 20 2.87,0.975; 21 2.87,1.625; 22 2.87,2.275; 23 2.87,2.925; 24 2.87,3.575
PJ-036AH = smd 4.4 x 3.3: 1 2.2,-0.65 | smd 6.75 x 3.9: 2 -6.75,6.45 | smd 6.2 x 3.9: 3 -6.75,-6.45

### Placement (x,y rotation side)
ATTRIBUTES  92.2,34.04 0 top
C1  153.92,32.77 0 top
C3  130.3,55.88 90 top
C9  153.92,35.56 0 top
C11  153.42,38.1 0 top
D1  154.43,29.46 0 top
D2  98.55,28.19 90 top
D3  98.55,31.5 90 top
D4  98.81,24.89 90 top
F11  151.64,22.86 90 top
F12  145.03,22.86 90 top
IC2  149.86,74.8 180 top
IC3  129.79,74.8 180 top
IC4  89.66,74.8 180 top
IC5  109.73,74.8 180 top
J1  155.19,59.18 270 top
J2  150.62,90.17 180 top
J3  130.56,90.17 180 top
J4  90.42,90.17 180 top
J5  110.49,90.17 180 top
R1  140.34,58.8 0 top
R2  142.16,51.49 180 top
R3  145.16,51.49 180 top
R4  142.19,56.03 180 top
R5  145.16,56.03 180 top
R6  142.16,53.77 180 top
R7  145.16,53.77 180 top
R8  63.65,61.67 90 top
R9  72.26,61.65 270 top
R10  105.41,28.19 0 top
R11  105.41,31.5 0 top
R12  105.41,24.89 0 top
R16  150.88,71.5 0 top
R17  147.83,71.5 0 top
R18  144.78,71.5 0 top
R19  144.27,74.04 270 top
R20  146.81,77.98 180 top
R21  144.27,77.09 270 top
R22  154.81,74.42 270 top
R23  157.61,74.42 270 top
R24  130.81,71.5 0 top
R25  127.76,71.5 0 top
R26  124.71,71.5 0 top
R27  124.21,74.04 270 top
R28  126.75,77.98 180 top
R29  124.21,77.09 270 top
R30  134.75,74.42 270 top
R31  137.54,74.42 270 top
R32  90.68,71.5 0 top
R33  87.63,71.5 0 top
R34  84.58,71.5 0 top
R35  84.07,74.04 270 top
R36  86.61,77.98 180 top
R37  84.07,77.09 270 top
R38  94.61,74.42 270 top
R39  97.41,74.42 270 top
R40  110.74,71.5 0 top
R41  107.7,71.5 0 top
R42  104.65,71.5 0 top
R43  104.14,74.04 270 top
R44  106.68,77.98 180 top
R45  104.14,77.09 270 top
R46  114.68,74.42 270 top
R47  117.47,74.42 270 top
SV1  56.13,56.64 0 top
T1  149.35,36.83 90 top
U1  135.64,53.85 270 top
U$1  128.02,18.03 90 top
U$3  106.17,18.03 90 top

### Tracks (layer width: path | path; a pad name or v marks a point on that pad's centre or on a via)
24V_IN
  Top 1.27: F11.1 151.64,15.24 F12.1 140.04,20.23 U$1.1
  pour Top (isolate 0.406): 103.38,23.11 103.38,15.24 138.68,15.24 138.68,12.45 154.69,12.45 154.69,21.59 131.83,21.59 131.83,23.11
+3V3  (via drill 0.35)
  Top 0.305: U1.24 139.72,51.49 140.21,51.49 | 140.21,51.49 R2.2 | R6.2 140.28,53.77 | 140.28,53.77 v140.21,53.85 | 140.21,51.49 v140.21,50.8 140.72,50.29 v140.72,47.24 | R4.2 140.36,56.03 v140.21,55.88 | R1.2 142.11,58.8 v142.24,58.67 | C3.1 131.56,53.77 140.28,53.77 | IC2.1 153.42,73.8 | 153.42,73.8 154.03,73.8 154.27,73.57 R22.2 R23.2 | 153.42,73.8 153.42,70.36 v140.97,70.36 | IC3.1 133.35,73.8 | 133.35,73.8 133.97,73.8 134.2,73.57 R30.2 R31.2 | 133.35,70.36 133.35,73.8 | IC5.1 113.28,73.8 | 113.28,73.8 113.9,73.8 114.13,73.57 R46.2 R47.2 | 113.28,70.36 113.28,73.8 | IC4.1 93.22,73.8 | 93.22,73.8 93.84,73.8 94.07,73.57 R38.2 R39.2 | 93.22,70.36 93.22,73.8 | 93.22,70.36 v97.79,70.36 | v101.09,70.36 113.28,70.36 | 113.28,70.36 v117.86,70.36 | v121.41,70.36 133.35,70.36 | 133.35,70.36 v137.67,70.36 | R10.2 107.81,29.82 124.56,29.82 v137.41,42.67 | R9.2 72.17,60.71 v69.34,60.71 | 56.93,62.52 R8.2 66.26,62.52 v66.29,62.48 66.55,62.48 69.14,65.08 75.49,65.08 80.77,70.36 93.22,70.36 | 56.93,62.52 SV1.17 | SV1.1 36.61,62.52 56.93,62.52
  Bottom 0.305: v140.21,50.8 v140.21,53.85 v140.21,55.88 140.21,56.51 arc-45 140.3,56.73 v142.24,58.67 140.97,59.94 v140.97,70.36 v137.67,70.36 | v97.79,70.36 v101.09,70.36 | v117.86,70.36 v121.41,70.36 | v137.41,42.67 140.72,45.97 v140.72,47.24 | v66.29,62.48 68.07,60.71 v69.34,60.71
+5V  (via drill 0.35)
  Top 0.305: IC2.10 145.43,73.8 144.78,73.15 144.31,73.15 | 144.31,73.15 R19.2 | 144.31,73.15 143.93,72.77 R18.1 140.84,71.5 v140.72,71.63 | IC3.10 125.87,73.8 125.22,73.15 124.25,73.15 | 124.25,73.15 R27.2 | 124.25,73.15 123.86,72.77 R26.1 123.74,71.63 v120.9,71.63 | IC5.10 106.06,73.8 105.41,73.15 104.18,73.15 | 104.18,73.15 R43.2 | 104.18,73.15 103.8,72.77 R42.1 100.71,71.5 v100.58,71.63 | IC4.10 86,73.8 85.34,73.15 84.11,73.15 | 84.11,73.15 R35.2 | 84.11,73.15 83.73,72.77 R34.1 82.17,71.5 v82.04,71.63 | v102.87,61.72 102.87,60.66 | R11.2 107.25,30.43 124.05,30.43 136.04,42.42 136.04,45.12
  Top 0.61: T1.3 136.04,45.12 132.91,45.12 117.37,60.66 102.87,60.66 93.23,60.66 84.9,52.32 37.59,52.32 | 37.59,52.32 34.54,52.32 32,54.86 SV1.2 SV1.4 37.59,52.32
  Bottom 0.305: v82.04,71.63 v100.58,71.63 | v100.58,71.63 v120.9,71.63 v140.72,71.63 | v100.58,71.63 101.02,71.19 101.44,71.19 101.93,70.7 101.93,62.66 v102.87,61.72
+24V  (via drill 0.55)
  Top 0.305: R12.2 107.7,24.89 112.01,29.21 143.76,29.21 F12.2
  Top 1.27: F12.2 145.03,29.46 D1.C | F11.2 152.41,25.49 D1.C | D1.C 152.41,32.77 C1.1 152.43,35.56 C9.1 152.52,38.1 C11.1 147.35,38.1 T1.1
  Bottom 0.61: v153.67,40.64 155.7,40.64 155.7,42.42
  other vias: 152.4,40.64 151.13,40.64 149.86,40.64 153.67,39.37 152.4,39.37 151.13,39.37 149.86,39.37
  pour Top (isolate 0.406): 153.92,24.64 153.92,40.89 143.76,40.89 143.76,24.64
  pour Bottom (isolate 0.254): 161.8,38.61 150.11,38.61 150.11,48.77 154.43,48.77 154.43,80.52 0.76,80.52 1.27,102.11 162.05,102.11
A0_EXT_1
  Top 0.305: R5.2 R4.1 143.04,56.73 arc45 142.95,56.95 142.59,57.31 arc45 142.36,57.4 139.9,57.4 U1.1
A1_EXT_1
  Top 0.305: R7.2 R6.1 143.01,54.47 arc45 142.92,54.69 142.84,54.77 arc45 142.62,54.86 139.07,54.86 arc-45 138.84,54.96 138.65,55.15 arc-45 138.56,55.37 U1.2
A2_EXT_1
  Top 0.305: R3.2 R2.1 143.01,52.18 arc45 142.92,52.41 142.84,52.48 arc45 142.62,52.58 137.58,52.58 arc90 137.26,52.26 U1.21
DSCLM0
  Top 0.305: R21.1 144.31,77.98 145.8,77.98 | IC2.6 146.19,75.8 145.8,76.2 145.8,77.98 | J2.DSCLM(5) 149.99,83.06 149.61,82.68 147.96,82.68 147.45,82.17 147.45,80.26 146.05,78.87 146.05,77.98 R20.2 145.8,77.98
DSCLM1  (1 unrouted)
  Top 0.305: R29.1 124.25,77.98 125.73,77.98 | 125.73,77.98 R28.2 | IC3.6 126.13,75.8 125.73,76.2 125.73,77.98 | 125.98,77.98 125.98,78.87 127.38,80.26 127.38,82.17 127.89,82.68 129.54,82.68 129.92,83.06 J3.DSCLM(5)
DSCLM2
  Top 0.305: R45.1 104.18,77.98 105.66,77.98 | 105.66,77.98 R44.2 105.92,77.98 105.92,78.87 107.31,80.26 107.31,82.17 107.82,82.68 109.47,82.68 109.86,83.06 J5.DSCLM(5) | IC5.6 106.06,75.8 105.66,76.2 105.66,77.98
DSCLM3  (1 unrouted)
  Top 0.305: R37.1 84.11,77.98 85.6,77.98 | 85.6,77.98 R36.2 | IC4.6 86,75.8 85.6,76.2 85.6,77.98 | 85.85,77.98 85.85,78.87 87.25,80.26 87.25,82.17 87.76,82.68 89.41,82.68 89.79,83.06 J4.DSCLM(5)
DSCLP0
  Top 0.305: R21.2 R19.1 144.82,75.31 145.29,75.31 145.42,75.3 IC2.7 148.84,75.3 149.1,75.56 149.1,79.12 J2.DSCLP(4)
DSCLP1
  Top 0.305: R29.2 R27.1 124.75,75.31 125.22,75.31 125.36,75.3 IC3.7 128.77,75.3 129.03,75.56 129.03,79.12 J3.DSCLP(4)
DSCLP2
  Top 0.305: R45.2 R43.1 104.69,75.31 105.16,75.31 105.29,75.3 IC5.7 108.7,75.3 108.97,75.56 108.97,79.12 J5.DSCLP(4)
DSCLP3
  Top 0.305: R37.2 R35.1 84.62,75.31 85.09,75.31 85.22,75.3 IC4.7 88.64,75.3 88.9,75.56 88.9,79.12 J4.DSCLP(4)
DSDAM0  (via drill 0.35)
  Top 0.305: J2.DSDAM(2) 153.8,80.9 150.37,77.22 150.37,76.96 | IC2.9 149.35,74.3 150.37,75.06 150.37,76.96 | R17.2 R16.1 arc-90 149.86,71.67 v149.86,72.64 149.86,72.77 | v151.13,76.96 150.37,76.96
  Bottom 0.305: v149.86,72.64 149.86,76.96 v151.13,76.96
DSDAM1  (via drill 0.35)
  Top 0.305: J3.DSDAM(2) 133.73,80.9 130.3,77.22 130.3,76.96 | IC3.9 127.6,74.3 129.29,74.3 130.3,75.06 130.3,76.96 | R25.2 R24.1 arc-90 129.79,71.67 v129.79,72.64 129.79,72.77 | v131.06,76.96 130.3,76.96
  Bottom 0.305: v129.79,72.64 129.79,76.96 v131.06,76.96
DSDAM2  (via drill 0.35)
  Top 0.305: J5.DSDAM(2) 113.67,80.9 110.24,77.22 110.24,76.96 | IC5.9 109.22,74.3 110.24,75.06 110.24,76.96 | R41.2 R40.1 arc-90 109.73,71.67 v109.73,72.64 109.73,72.77 | v111,76.96 110.24,76.96
  Bottom 0.305: v109.73,72.64 109.73,76.96 v111,76.96
DSDAM3  (via drill 0.35)
  Top 0.305: J4.DSDAM(2) 93.6,80.9 90.17,77.22 90.17,76.96 | IC4.9 89.15,74.3 90.17,75.06 90.17,76.96 | R33.2 R32.1 arc-90 89.66,71.67 v89.66,72.64 89.66,72.77 | v90.93,76.96 90.17,76.96
  Bottom 0.305: v89.66,72.64 89.66,76.96 v90.93,76.96
DSDAP0  (via drill 0.35)
  Top 0.254: IC2.8 148.98,74.8 149.68,75.38
  Top 0.305: R18.2 R17.1 146.98,72.81 v147.07,72.9 | 149.68,75.39 149.73,75.56 | 149.73,75.56 149.73,77.85 150.62,78.74 | 150.62,78.74 152.53,80.64 152.53,81.92 153.29,82.68 153.92,82.68 J2.DSDAP(1) | v150.11,78.99 150.37,78.99 150.62,78.74 | 149.68,75.38 149.68,75.51 149.73,75.56
  Bottom 0.305: v147.07,72.9 149.1,74.93 149.1,78.74 149.35,78.99 v150.11,78.99
DSDAP1  (via drill 0.35)
  Top 0.254: IC3.8 128.92,74.8 129.62,75.38
  Top 0.305: R26.2 R25.1 126.91,72.81 v127,72.9 | 130.56,78.74 129.67,77.85 129.67,75.56 129.62,75.39 129.62,75.38 | 130.56,78.74 132.46,80.64 132.46,81.92 133.22,82.68 133.86,82.68 J3.DSDAP(1) | v130.05,78.99 130.3,78.99 130.56,78.74
  Bottom 0.305: v127,72.9 129.03,74.93 129.03,78.74 129.29,78.99 v130.05,78.99
DSDAP2  (via drill 0.35)
  Top 0.254: IC5.8 108.85,74.8 109.55,75.38
  Top 0.305: R42.2 R41.1 106.85,72.81 v106.93,72.9 | 110.49,78.74 109.6,77.85 109.6,75.56 109.55,75.39 109.55,75.38 | 110.49,78.74 112.39,80.64 112.39,81.92 113.16,82.68 113.79,82.68 J5.DSDAP(1) | v109.98,78.99 110.24,78.99 110.49,78.74
  Bottom 0.305: v106.93,72.9 108.97,74.93 108.97,78.74 109.22,78.99 v109.98,78.99
DSDAP3  (via drill 0.35)
  Top 0.254: IC4.8 88.78,74.8 89.48,75.38
  Top 0.305: R34.2 R33.1 86.78,72.81 v86.87,72.9 | 90.42,78.74 89.53,77.85 89.53,75.56 89.48,75.39 89.48,75.38 | 90.42,78.74 92.33,80.64 92.33,81.92 93.09,82.68 93.73,82.68 J4.DSDAP(1) | v89.92,78.99 90.17,78.99 90.42,78.74
  Bottom 0.305: v86.87,72.9 88.9,74.93 88.9,78.74 89.15,78.99 v89.92,78.99
GND  (via drill 0.35, 0.55)
  Top 0.305: C3.2 U1.12 130.61,58.17 v129.54,58.17 | R5.1 R7.1 R3.1
  other vias: 152.65,77.22 152.4,72.9 147.57,76.71 148.34,79.5 132.59,77.22 132.33,72.9 127.51,76.71 128.02,79.25 112.52,77.22 112.27,72.9 107.44,76.71 108.2,79.5 92.46,77.22 92.2,72.9 87.38,76.71 88.14,79.5 80.52,67.82 78.23,70.1 67.31,76.71 86.36,61.98 104.14,66.29 52.07,72.9 133.6,63.75 48.01,79.5 123.19,60.96 32,72.9 27.18,76.71 27.94,79.5 116.59,57.91 27.94,64.26 109.47,32.51 7.87,79.5 158.24,35.56 159.51,32.77 155.96,26.42 159.51,25.15 137.67,8.89 127,12.19 152.65,50.04 144.78,68.07 152.91,67.82 120.4,78.23 139.95,78.23 102.62,78.74 82.04,78.99 100.08,66.29 41.66,78.99 115.06,66.29 145.8,64.52 133.6,26.42 112.27,27.18 99.82,20.32 92.2,11.68 131.83,35.31 66.8,64.52 52.32,50.04 74.17,50.29 120.14,47.24 44.45,60.71 59.44,60.71 129.29,37.59 30.48,21.59 61.47,9.65 32.77,51.82 17.78,44.96 17.02,56.64 1.78,61.47 48.01,65.02 93.47,57.91 90.17,60.96 160.02,8.89 116.84,8.89 117.09,13.46 109.98,24.64 145.8,59.44
  pour Top (isolate 0.305): 143,101.6 143,70.1 158.75,70.1 158.75,101.6
  pour Top (isolate 0.305): 122.94,101.6 122.94,70.1 138.68,70.1 138.68,101.6
  pour Top (isolate 0.305): 102.87,101.6 102.87,70.1 118.62,70.1 118.62,101.6
  pour Top (isolate 0.305): 82.8,101.6 82.8,70.1 98.55,70.1 98.55,101.6
  pour Top (isolate 0.305): 62.74,101.6 62.74,70.1 78.49,70.1 78.49,101.6
  pour Top (isolate 0.305): 42.67,101.6 42.67,70.1 58.42,70.1 58.42,101.6
  pour Top (isolate 0.305): 22.61,101.6 22.61,70.1 38.35,70.1 38.35,101.6
  pour Top (isolate 0.305): 2.54,101.6 2.54,70.1 18.29,70.1 18.29,101.6
  pour Top (isolate 0.406, rank 2): -0.51,101.85 162.05,101.85 162.56,-0.25 0,-0.25 -0.25,49.28
  pour Bottom (isolate 0.406, rank 2): -0.25,101.85 162.05,101.85 162.56,-0.25 -0.25,-0.25
N$2
  Top 0.305: R11.1 D3.A
N$4
  Top 0.305: R12.1 D4.A
N$12
  Top 0.305: R10.1 D2.A
RESET1
  Top 0.305: R1.1 138.44,58.8 arc45 138.21,58.71 138,58.5 arc45 137.91,58.28 U1.3
SC0
  Top 0.305: U1.5 136.61,63.75 142.36,69.5 arc-45 142.59,69.6 158.62,69.6 arc45 158.84,69.69 159,69.85 159,74.93 158.66,75.27 R23.1 157.61,75.82 157.23,76.45 153.67,76.45 153.67,75.69 153.28,75.3 IC2.4
SC1
  Top 0.305: U1.7 135.31,63.75 135.35,63.79 135.35,64.22 138.94,67.81 138.94,74.93 138.6,75.27 R31.1 137.54,75.82 137.16,76.45 133.6,76.45 133.6,75.69 133.22,75.3 IC3.4
SC2
  Top 0.305: IC5.4 113.15,75.3 113.54,75.69 113.54,76.45 117.09,76.45 117.47,75.82 R47.1 118.4,75.27 118.87,74.8 118.87,69.75 119.89,68.73 125.22,68.73 134.01,59.94 U1.9
SC3
  Top 0.305: U1.11 132.72,58.42 132.72,58.96 124.17,67.51 119.33,67.51 118.11,68.73 99.82,68.73 98.81,69.75 98.81,74.93 98.46,75.27 R39.1 97.41,75.82 97.03,76.45 93.47,76.45 93.47,75.69 93.08,75.3 IC4.4
SCL
  Top 0.305: U1.22 137.91,49.52 137.47,49.07 131.65,49.07 118.56,62.17 105.22,62.17 104.14,63.25 97.5,63.25 96.28,64.47 69.67,64.47 64.83,59.63 | SV1.28 65.02,55.4 63.68,56.74 63.68,58.47 64.83,59.63 | R8.1 63.65,60.81 64.83,59.63
SD0  (via drill 0.35)
  Top 0.305: U1.4 137.26,63.5 137.93,64.17 142.81,68.97 143.08,68.97 143.02,68.99 159.19,68.99 159.77,69.57 v159.77,75.18 | IC2.2 153.3,74.3 154.27,75.27 R22.1 156.12,75.27 v156.21,75.18
  Bottom 0.305: v156.21,75.18 v159.77,75.18
SD1  (via drill 0.35)
  Top 0.305: U1.6 135.96,63.75 136,63.79 136,64.01 139.7,67.7 v139.7,75.18 | IC3.2 133.23,74.3 134.2,75.27 R30.1 136.06,75.27 v136.14,75.18
  Bottom 0.305: v136.14,75.18 v139.7,75.18
SD2  (via drill 0.35)
  Top 0.305: IC5.2 113.17,74.3 114.13,75.27 R46.1 115.99,75.27 v116.08,75.18 | v119.63,75.18 119.63,70.36 120.65,69.34 125.73,69.34 134.66,60.41 U1.8
  Bottom 0.305: v116.08,75.18 v119.63,75.18
SD3  (via drill 0.35)
  Top 0.305: U1.10 133.36,59.48 124.72,68.12 119.58,68.12 118.36,69.34 100.08,69.34 99.57,69.85 v99.57,75.18 | IC4.2 93.1,74.3 94.07,75.27 R38.1 95.92,75.27 v96.01,75.18
  Bottom 0.305: v96.01,75.18 v99.57,75.18
SDA
  Top 0.305: U1.23 138.56,49.15 137.82,48.41 131.2,48.41 118.13,61.48 104.78,61.48 103.63,62.64 97.25,62.64 96.03,63.86 72.14,63.86 | SV1.27 70.97,63.86 72.14,63.86 | R9.1 72.26,63.73 72.14,63.86
USBM1  (via drill 0.35)
  Top 0.305: 152.9,58.16 v152.91,58.17 156.41,58.17 J1.3
  Bottom 0.305: J3.USBM(8) 126.11,80.9 125.98,80.77 126.75,80.01 140.72,80.01 141.99,78.74 141.99,62.23 143.76,60.45 150.62,60.45 v152.91,58.17
USBP1  (via drill 0.35)
  Top 0.305: v152.91,60.2 156.39,60.2 J1.2
  Bottom 0.305: J3.USBP(7) 127.38,84.71 128.52,85.85 138.68,85.85 142.75,81.79 142.75,62.99 144.53,61.21 151.89,61.21 v152.91,60.2

### Text on the board
tPlace: 3.3V | GND | 5V | 5V | 3.3V | 24V
tNames: I2C / CH:7 | I2C / CH:6 | I2C / CH:5 | I2C / CH:4 | I2C / CH:3 | I2C / CH:2 | I2C / CH:1 | I2C / CH:0 | SCL Pullup | SDA Pullup